# Altium schematic sheet MCU_PWR.SchDoc
size A4; Organization: Altium Limited; Address1: L3, 12a Rodborough Rd; Address2: Frenchs Forest; Address3: NSW; Address4: Australia 2086; SheetNumber: 3; SheetTotal: 5
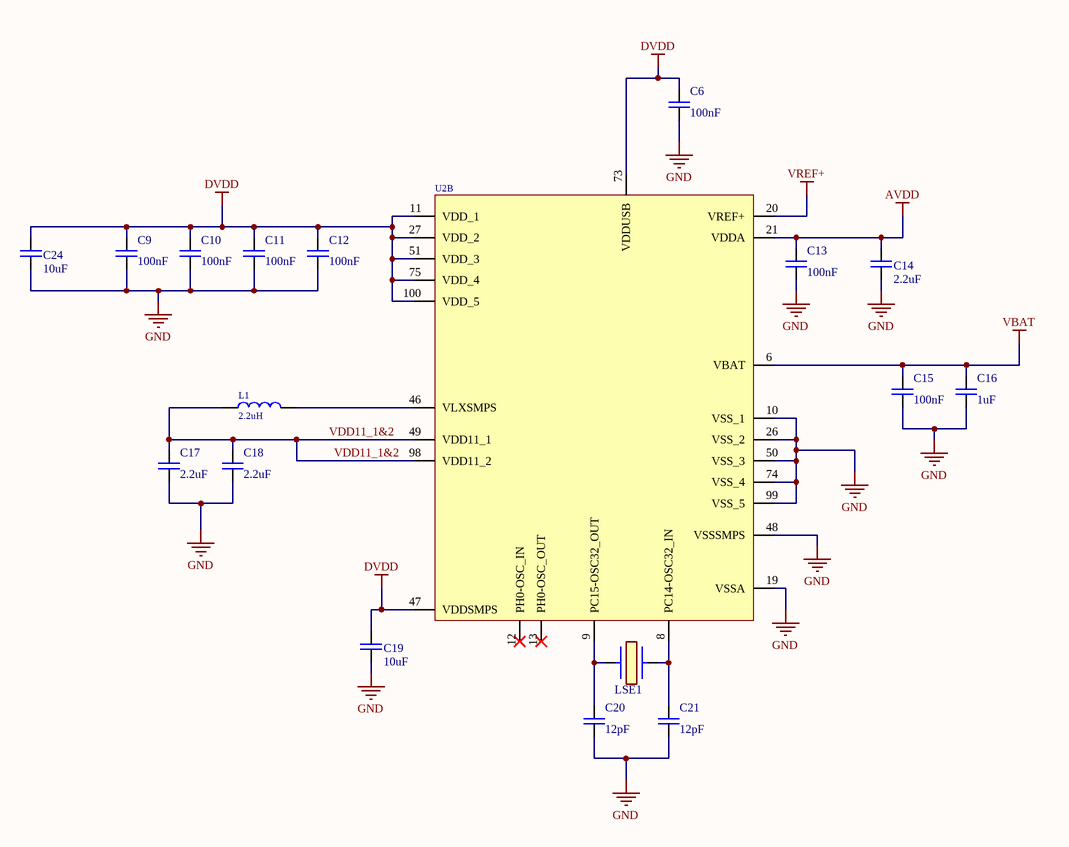
[diagram p0: MCU_PWR.SchDoc]

## Parts
C6  100nF  [CAP_SM0805_YAGEOCC2_N]
C9  100nF  [CAP_SM0805_YAGEOCC2_N]
C10  100nF  [CAP_SM0805_YAGEOCC2_N]
C11  100nF  [CAP_SM0805_YAGEOCC2_N]
C12  100nF  [CAP_SM0805_YAGEOCC2_N]
C13  100nF  [CAP_SM0805_YAGEOCC2_N]
C14  2.2uF  [CAP_SM0805_YAGEOCC2_N]
C15  100nF  [CAP_SM0805_YAGEOCC2_N]
C16  1uF  [CAP_SM0805_YAGEOCC2_N]
C17  2.2uF  [CAP_SM0805_YAGEOCC2_N]
C18  2.2uF  [CAP_SM0805_YAGEOCC2_N]
C19  10uF  [CAP_SM0805_YAGEOCC2_N]
C20  12pF  [CAP_SM0805_YAGEOCC2_N]
C21  12pF  [CAP_SM0805_YAGEOCC2_N]
C24  10uF  [CAP_SM0805_YAGEOCC2_N]
L1  2.2uH  [LQM21PN2R2MGHL]
LSE1  32,768 kHz  [SC-32S32.768kHz20PPM12.5pF]  (value not drawn)
U2  STM32U575VI_1  [STM32U575VI]  (value not drawn)  (part B of 3)

## Nets
AVDD: C13.1 C14.1 U2.21(VDDA)
DVDD: C6.1 C9.1 C10.1 C11.1 C12.1 C19.1 C24.1 U2.11(VDD_1) U2.27(VDD_2) U2.47(VDDSMPS) U2.51(VDD_3) U2.73(VDDUSB) U2.75(VDD_4) U2.100(VDD_5)
GND: C6.2 C9.2 C10.2 C11.2 C12.2 C13.2 C14.2 C15.2 C16.2 C17.2 C18.2 C19.2 C20.2 C21.2 C24.2 U2.10(VSS_1) U2.19(VSSA) U2.26(VSS_2) U2.48(VSSSMPS) U2.50(VSS_3) U2.74(VSS_4) U2.99(VSS_5)
VBAT: C15.1 C16.1 U2.6(VBAT)
VREF+: U2.20(VREF+)
VDD11_1&2: C17.1 C18.1 L1.1 U2.49(VDD11_1) U2.98(VDD11_2)
NetC20_1: C20.1 LSE1.1 U2.9(PC15-OSC32_OUT)
NetC21_1: C21.1 LSE1.2 U2.8(PC14-OSC32_IN)
NetL1_2: L1.2 U2.46(VLXSMPS)

Not connected (* = marked no-connect by the designer): U2 12(PH0-OSC_IN)* 13(PH0-OSC_OUT)*

## Notes on the sheet
- Title:
- Size: A4
- Date:
- FMC-320U MODEL A
- Sheet:
- Time:
- Of:
- Version:
- Revision:
- Release:
- 1
- 0
- FLOWMEET SRL
- File

## Library data of the parts
C6 C9-C13 C15 = CC0805KRX7R9BB104: CAP 100nF SM0805 X7R 50V YAGEO CC2; Tolerance (%): 10; Voltage Rating (Volts): 50; Category: Capacitor; Manufacturer: Yageo; Manufacturer Part Number: CC0805KRX7R9BB104; Package: 0805; Value: 100nF; Supplier Part Number 1: 3019949; Supplier 1: Farnell; ComponentLink1URL: http://www.yageo.com; ComponentLink1Description: Manufacturer Website; Supplier 2: Digi-Key; Supplier Part Number 2: 311-1140-1-ND
C14 C17 C18 = CC0805KKX7R8BB225: CAP 2u2F SM0805 X7R 25V YAGEO CC2; Tolerance (%): 10; Voltage Rating (Volts): 25; Category: Capacitor; Manufacturer: Yageo; Manufacturer Part Number: CC0805KKX7R8BB225; Package: 0805; Value: 2.2uF; Supplier Part Number 1: 1458904; Supplier 1: Farnell; ComponentLink1URL: http://www.yageo.com; ComponentLink1Description: Manufacturer Website; Supplier 2: Digi-Key
C16 = CC0805KKX7R8BB105: CAP 1uF SM0805 X7R 25V YAGEO CC2; Tolerance (%): 10; Voltage Rating (Volts): 25; Category: Capacitor; Manufacturer: Yageo; Manufacturer Part Number: CC0805KKX7R8BB105; Package: 0805; Value: 1uF; Supplier Part Number 1: 1458903; Supplier 1: Farnell; ComponentLink1URL: http://www.yageo.com; ComponentLink1Description: Manufacturer Website; Supplier 2: Digi-Key; Supplier Part Number 2: 311-1456-1-ND
C19 C24 = CC0805KKX5R8BB106: CAP 10uF SM0805 X5R 25V YAGEO; Tolerance: 10; Category: Capacitor; Manufacturer: Yageo; Manufacturer Part Number: CC0805KKX5R8BB106; Package: 0805; Value: 10uF; ComponentLink1Description: Manufacturer Website; ComponentLink1URL: http://www.yageo.com
C20 C21 = CC0805JRNPO9BN120: CAP 12pF SM0805 NPO 50V YAGEO CC2; Tolerance (%): 5; Voltage Rating (Volts): 50; Category: Capacitor; Manufacturer: Yageo; Manufacturer Part Number: CC0805JRNPO9BN120; Package: 0805; Value: 12pF; ComponentLink1URL: http://www.yageo.com; ComponentLink1Description: Manufacturer Website
L1 = LQM21PN2R2MGHL: Inductores de potencia - SMD 2.2 UH 20%; Manufacturer: Murata Electronics; Manufacturer Part Number: LQM21PN2R2MGHL; Category: Inductor; Value: 2.2uH; Datasheet: https://ar.mouser.com/datasheet/2/281/1/JELF243B_0040-961444.pdf
LSE1 = SC32S-12.5PF20PPM: Cristal Oscilador 32.768 kHz, 12.5pF; Manufacturer: Seiko; Manufacturer Part Number: SC32S-12.5PF20PPM; Category: Cristal Oscilador; Value: 32,768 kHz; Datasheet: https://datasheet.lcsc.com/lcsc/1811151435_Seiko-SC-32S32-768kHz20PPM12-5pF_C97606.pdf
U2 = STM32U575VI_1: Manufacturer: ST; Manufacturer Part Number: STM32U575VIT6Q; Category: Microcontrolador; Datasheet: https://www.st.com/resource/en/datasheet/stm32u575ag.pdf